# EAGLE schematic prostownik_2k6p (EAGLE 9.0.1)
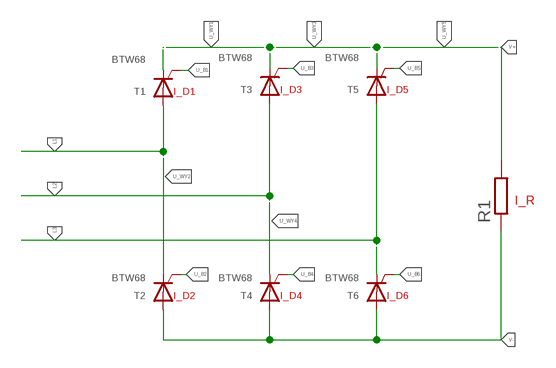
[diagram p0: schematic, sheet 1]

## Parts
R1  R-EU_0309/12  [0309/12]
T1  BTW68  [TOP3S-2]
T2  BTW68  [TOP3S-2]
T3  BTW68  [TOP3S-2]
T4  BTW68  [TOP3S-2]
T5  BTW68  [TOP3S-2]
T6  BTW68  [TOP3S-2]

## Nets
L1: T1.A
L2: T3.A
L3: T5.A
U_B1: T1.G
U_B2: T2.G
U_B3: T3.G
U_B4: T4.G
U_B5: T5.G
U_B6: T6.G
U_WY1: T1.C
U_WY2: T2.C
U_WY3: T3.C
U_WY4: T4.C
U_WY5: T5.C
U_WY6: T6.C
V+: R1.2
V-: R1.1 T2.A T4.A T6.A

## Library data of the parts
R1 = rcl:R-EU_: RESISTOR, European symbol; SPICEPREFIX: R
T1-T6 = triac:BTW68: THYRISTOR